# EAGLE design mixJTAG (EAGLE 7.2.0)

## Sheet 1 of 2
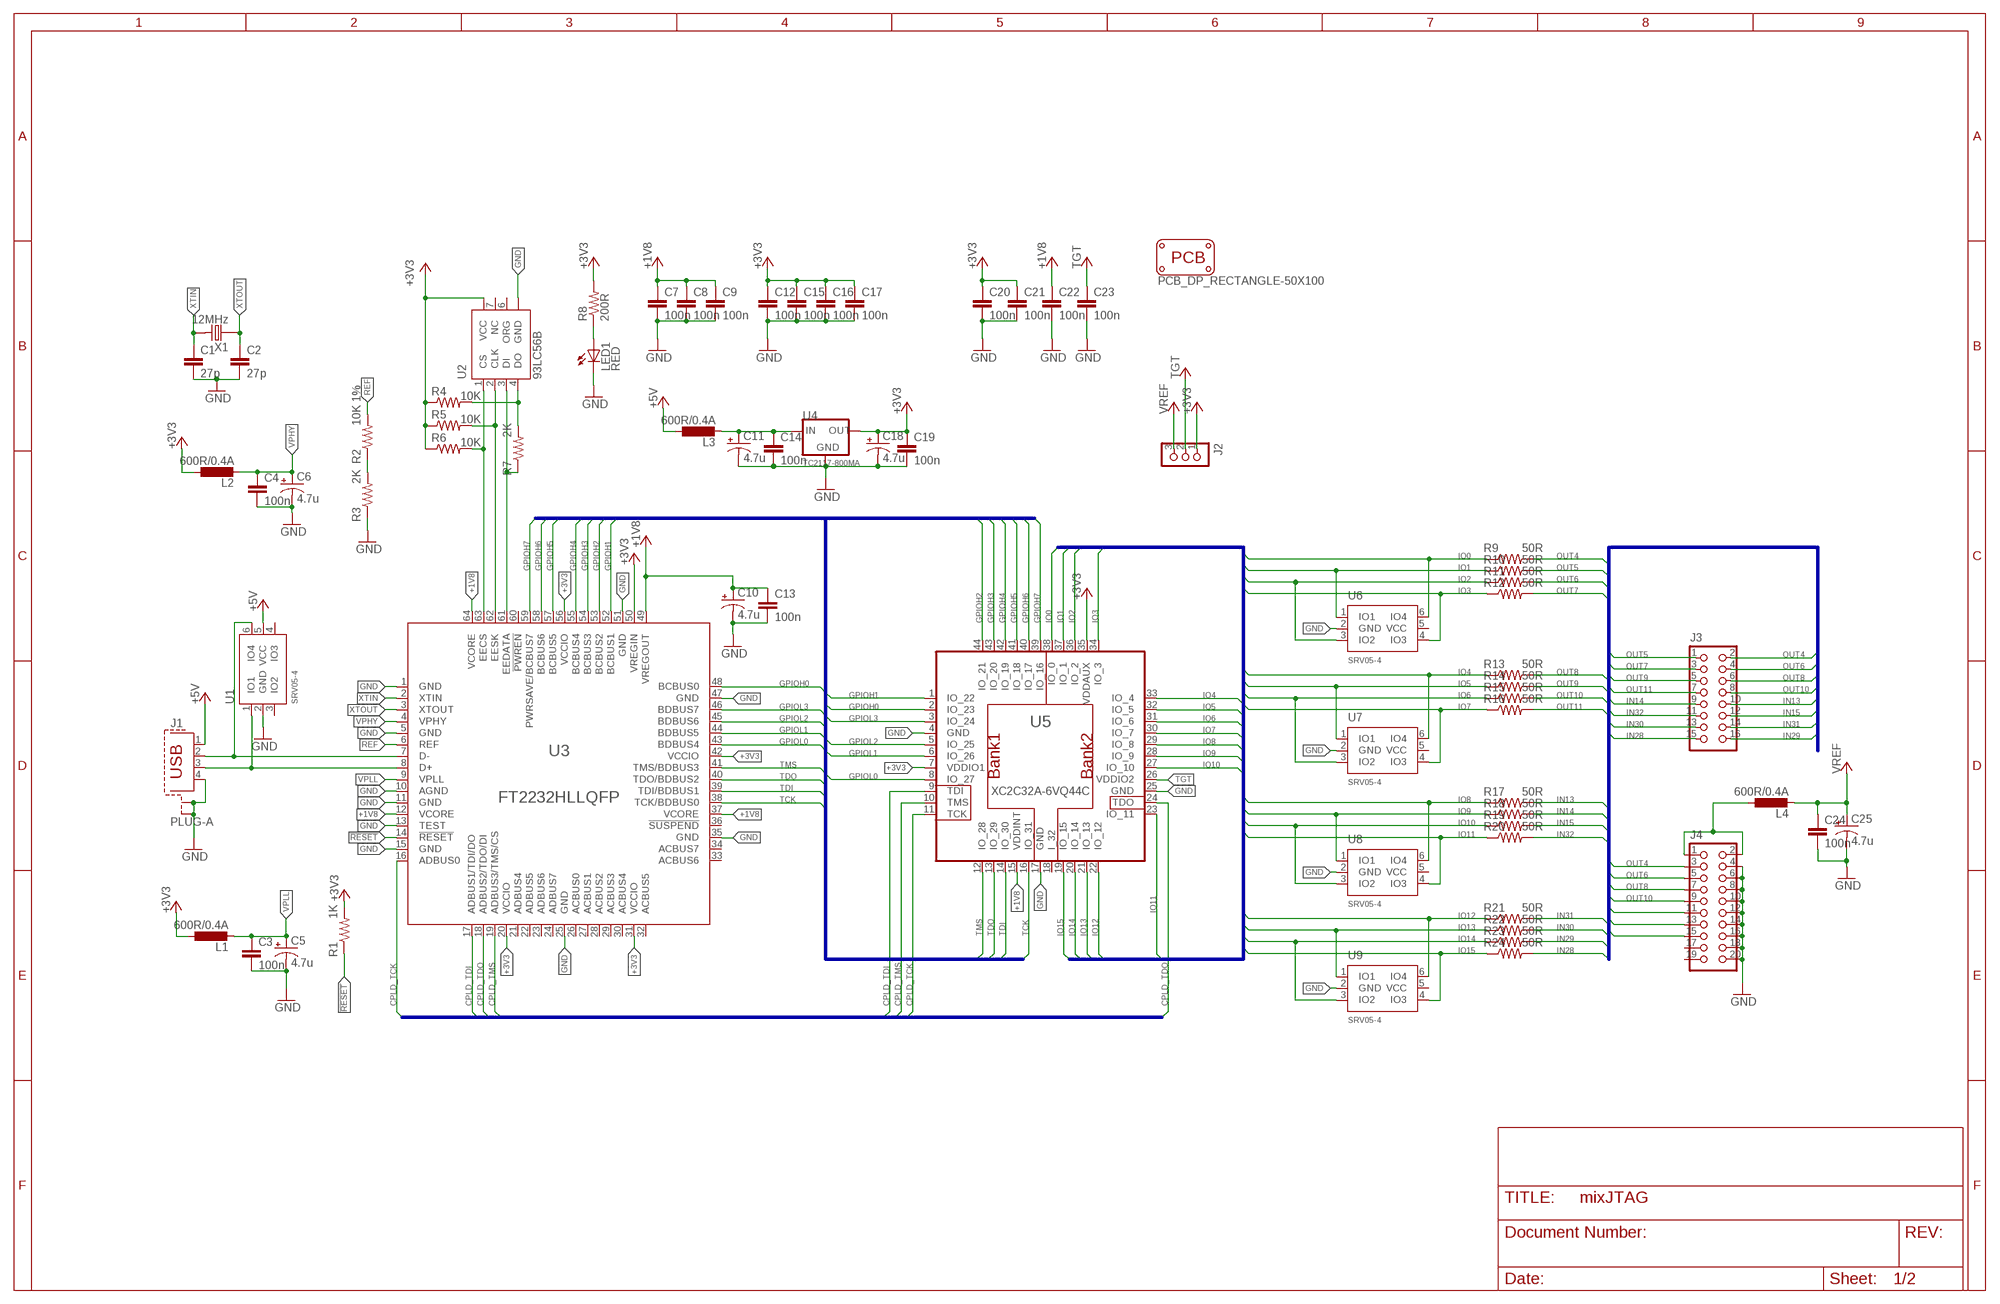
[diagram p0: schematic, sheet 1]

### Parts
C1  27p  C-EUC0805  [C0805]
C2  27p  C-EUC0805  [C0805]
C3  100n  C-EUC0805  [C0805]
C4  100n  C-EUC0805  [C0805]
C5  4.7u  CPOL-USA/3216-18R  [A/3216-18R]
C6  4.7u  CPOL-USA/3216-18R  [A/3216-18R]
C7  100n  C-EUC0805  [C0805]
C8  100n  C-EUC0805  [C0805]
C9  100n  C-EUC0805  [C0805]
C10  4.7u  CPOL-USA/3216-18R  [A/3216-18R]
C11  4.7u  CPOL-USA/3216-18R  [A/3216-18R]
C12  100n  C-EUC0805  [C0805]
C13  100n  C-EUC0805  [C0805]
C14  100n  C-EUC0805  [C0805]
C15  100n  C-EUC0805  [C0805]
C16  100n  C-EUC0805  [C0805]
C17  100n  C-EUC0805  [C0805]
C18  4.7u  CPOL-USA/3216-18R  [A/3216-18R]
C19  100n  C-EUC0805  [C0805]
C20  100n  C-EUC0805  [C0805]
C21  100n  C-EUC0805  [C0805]
C22  100n  C-EUC0805  [C0805]
C23  100n  C-EUC0805  [C0805]
C24  100n  C-EUC0805  [C0805]
C25  4.7u  CPOL-USA/3216-18R  [A/3216-18R]
J1  PLUG-A  USBPLUG-A  [USB-A-HOLE-PLUG]
J2  CON_HEADER_1X03-PTH  [M1X3]
J3  CON_HEADER_2X08  [M2X8]
J4  CON_HEADER_2X10-PTH  [M2X10]
L1  600R/0.4A  L-EUL2012C  [L2012C]
L2  600R/0.4A  L-EUL2012C  [L2012C]
L3  600R/0.4A  L-EUL2012C  [L2012C]
L4  600R/0.4A  L-EUL2012C  [L2012C]
LED1  RED  LEDCHIP-LED0805  [CHIP-LED0805]
PCB1  PCB_DP_RECTANGLE-50X100  [DP10050_V1]
R1  1K  R-US_R0805  [R0805]
R2  10K 1%  R-US_R0805  [R0805]
R3  2K  R-US_R0805  [R0805]
R4  10K  R-US_R0805  [R0805]
R5  10K  R-US_R0805  [R0805]
R6  10K  R-US_R0805  [R0805]
R7  2K  R-US_R0805  [R0805]
R8  200R  R-US_R0805  [R0805]
R9  50R  R-US_R0805  [R0805]
R10  50R  R-US_R0805  [R0805]
R11  50R  R-US_R0805  [R0805]
R12  50R  R-US_R0805  [R0805]
R13  50R  R-US_R0805  [R0805]
R14  50R  R-US_R0805  [R0805]
R15  50R  R-US_R0805  [R0805]
R16  50R  R-US_R0805  [R0805]
R17  50R  R-US_R0805  [R0805]
R18  50R  R-US_R0805  [R0805]
R19  50R  R-US_R0805  [R0805]
R20  50R  R-US_R0805  [R0805]
R21  50R  R-US_R0805  [R0805]
R22  50R  R-US_R0805  [R0805]
R23  50R  R-US_R0805  [R0805]
R24  50R  R-US_R0805  [R0805]
U1  SRV05-4  [SOT23-6]
U2  93LC56B  PIN2PIN-SOIC8  [SOIC8]
U3  FT2232HLLQFP  [LQFP-64]
U4  TC2117-800MA  [SOT223]
U5  XC2C32A-6VQ44C  [VQ-44]
U6  SRV05-4  [SOT23-6]
U7  SRV05-4  [SOT23-6]
U8  SRV05-4  [SOT23-6]
U9  SRV05-4  [SOT23-6]
X1  12MHz  XTSMD5032  [IQG5032A]

### Nets
!RESET: R1.1 U3.14(!RESET)
+1V8: C7.1 C8.1 C9.1 C10.+ C13.1 C22.1 U3.12(VCORE) U3.37(VCORE) U3.49(VREGOUT) U3.64(VCORE) U5.15(VDDINT)
+3V3: C12.1 C15.1 C16.1 C17.1 C18.+ C19.1 C20.1 C21.1 J2.1 L1.1 L2.1 R1.2 R4.1 R5.1 R6.1 R8.2 U2.8(VCC) U3.20(VCCIO) U3.31(VCCIO) U3.42(VCCIO) U3.50(VREGIN) U3.56(VCCIO) U4.2(OUT) U5.7(VDDIO1) U5.35(VDDAUX)
+5V: J1.1 L3.1 U1.5(VCC)
CPLD_TCK: U3.16(ADBUS0) U5.11(TCK)
CPLD_TDI: U3.17(ADBUS1/TDI/DO) U5.9(TDI)
CPLD_TDO: U3.18(ADBUS2/TDO/DI) U5.24(TDO)
CPLD_TMS: U3.19(ADBUS3/TMS/CS) U5.10(TMS)
EECS: R6.2 U2.1(CS) U3.63(EECS)
EEDATA: R7.1 U2.3(DI) U3.61(EEDATA)
EESK: R5.2 U2.2(CLK) U3.62(EESK)
GND: C1.2 C2.2 C3.2 C4.2 C5.- C6.- C7.2 C8.2 C9.2 C10.- C11.- C12.2 C13.2 C14.2 C15.2 C16.2 C17.2 C18.- C19.2 C20.2 C21.2 C22.2 C23.2 C24.2 C25.- J1.4 J1.S1 J1.S2 J4.4 J4.6 J4.8 J4.10 J4.12 J4.14 J4.16 J4.18 J4.20 LED1.C R3.1 U1.2(GND) U2.5(GND) U3.1(GND) U3.5(GND) U3.10(AGND) U3.11(GND) U3.13(TEST) U3.15(GND) U3.25(GND) U3.35(GND) U3.47(GND) U3.51(GND) U4.1(GND) U5.4(GND) U5.17(GND) U5.25(GND) U6.2(GND) U7.2(GND) U8.2(GND) U9.2(GND)
GPIOH0: U3.48(BCBUS0) U5.2(IO_23)
GPIOH1: U3.52(BCBUS1) U5.1(IO_22)
GPIOH2: U3.53(BCBUS2) U5.44(IO_21)
GPIOH3: U3.54(BCBUS3) U5.43(IO_20)
GPIOH4: U3.55(BCBUS4) U5.42(IO_19)
GPIOH5: U3.57(BCBUS5) U5.41(IO_18)
GPIOH6: U3.58(BCBUS6) U5.40(IO_17)
GPIOH7: U3.59(PWRSAVE/BCBUS7) U5.39(IO_16)
GPIOL0: U3.43(BDBUS4) U5.8(IO_27)
GPIOL1: U3.44(BDBUS5) U5.6(IO_26)
GPIOL2: U3.45(BDBUS6) U5.5(IO_25)
GPIOL3: U3.46(BDBUS7) U5.3(IO_24)
IN13: J3.10 J4.11 R17.2
IN14: J3.9 R18.2
IN15: J3.12 J4.13 R19.2
IN28: J3.15 R24.2
IN29: J3.16 R23.2
IN30: J3.13 R22.2
IN31: J3.14 J4.15 R21.2
IN32: J3.11 R20.2
IO0: R9.1 U5.38(IO_0) U6.6(IO4)
IO1: R10.1 U5.37(IO_1) U6.1(IO1)
IO2: R11.1 U5.36(IO_2) U6.3(IO2)
IO3: R12.1 U5.34(IO_3) U6.4(IO3)
IO4: R13.1 U5.33(IO_4) U7.6(IO4)
IO5: R14.1 U5.32(IO_5) U7.1(IO1)
IO6: R15.1 U5.31(IO_6) U7.3(IO2)
IO7: R16.1 U5.30(IO_7) U7.4(IO3)
IO8: R17.1 U5.29(IO_8) U8.6(IO4)
IO9: R18.1 U5.28(IO_9) U8.1(IO1)
IO10: R19.1 U5.27(IO_10) U8.3(IO2)
IO11: R20.1 U5.23(IO_11) U8.4(IO3)
IO12: R21.1 U5.22(IO_12) U9.6(IO4)
IO13: R22.1 U5.21(IO_13) U9.1(IO1)
IO14: R23.1 U5.20(IO_14) U9.3(IO2)
IO15: R24.1 U5.19(IO_15) U9.4(IO3)
N$1: J1.2 U1.6(IO4) U3.7(D-)
N$2: J1.3 U1.1(IO1) U3.8(D+)
N$3: C11.+ C14.1 L3.2 U4.3(IN)
N$4: J4.1 J4.2 L4.1
N$5: R2.1 R3.2
N$6: LED1.A R8.1
N$13: R4.2 R7.2 U2.4(DO)
OUT4: J3.2 J4.3 R9.2
OUT5: J3.1 R10.2
OUT6: J3.4 J4.5 R11.2
OUT7: J3.3 R12.2
OUT8: J3.6 J4.7 R13.2
OUT9: J3.5 R14.2
OUT10: J3.8 J4.9 R15.2
OUT11: J3.7 R16.2
REF: R2.2 U3.6(REF)
TCK: U3.38(TCK/BDBUS0) U5.16(IO_31)
TDI: U3.39(TDI/BDBUS1) U5.14(IO_30)
TDO: U3.40(TDO/BDBUS2) U5.13(IO_29)
TGT: C23.1 J2.2 U5.26(VDDIO2)
TMS: U3.41(TMS/BDBUS3) U5.12(IO_28)
VPHY: C4.1 C6.+ L2.2 U3.4(VPHY)
VPLL: C3.1 C5.+ L1.2 U3.9(VPLL)
VREF: C24.1 C25.+ J2.3 L4.2
XTIN: C1.1 U3.2(XTIN) X1.P$2
XTOUT: C2.1 U3.3(XTOUT) X1.P$1
Unconnected: J4.17 J4.19 U1.3(IO2) U1.4(IO3) U2.6(ORG) U2.7(NC) U3.21(ADBUS4) U3.22(ADBUS5) U3.23(ADBUS6) U3.24(ADBUS7) U3.26(ACBUS0) U3.27(ACBUS1) U3.28(ACBUS2) U3.29(ACBUS3) U3.30(ACBUS4) U3.32(ACBUS5) U3.33(ACBUS6) U3.34(ACBUS7) U3.36(!SUSPEND) U3.60(!PWREN) U5.18(I_32) U6.5(VCC) U7.5(VCC) U8.5(VCC) U9.5(VCC)

### Buses
TCK,TDI,TDO,TMS,GPIOL[0..3],GPIOH[0..7]
CPLD_TMS,CPLD_TDI,CPLD_TDO,CPLD_TCK
IO[0..15]
OUT[4..11],IN[13..15],IN[28..32]

## Sheet 2 of 2
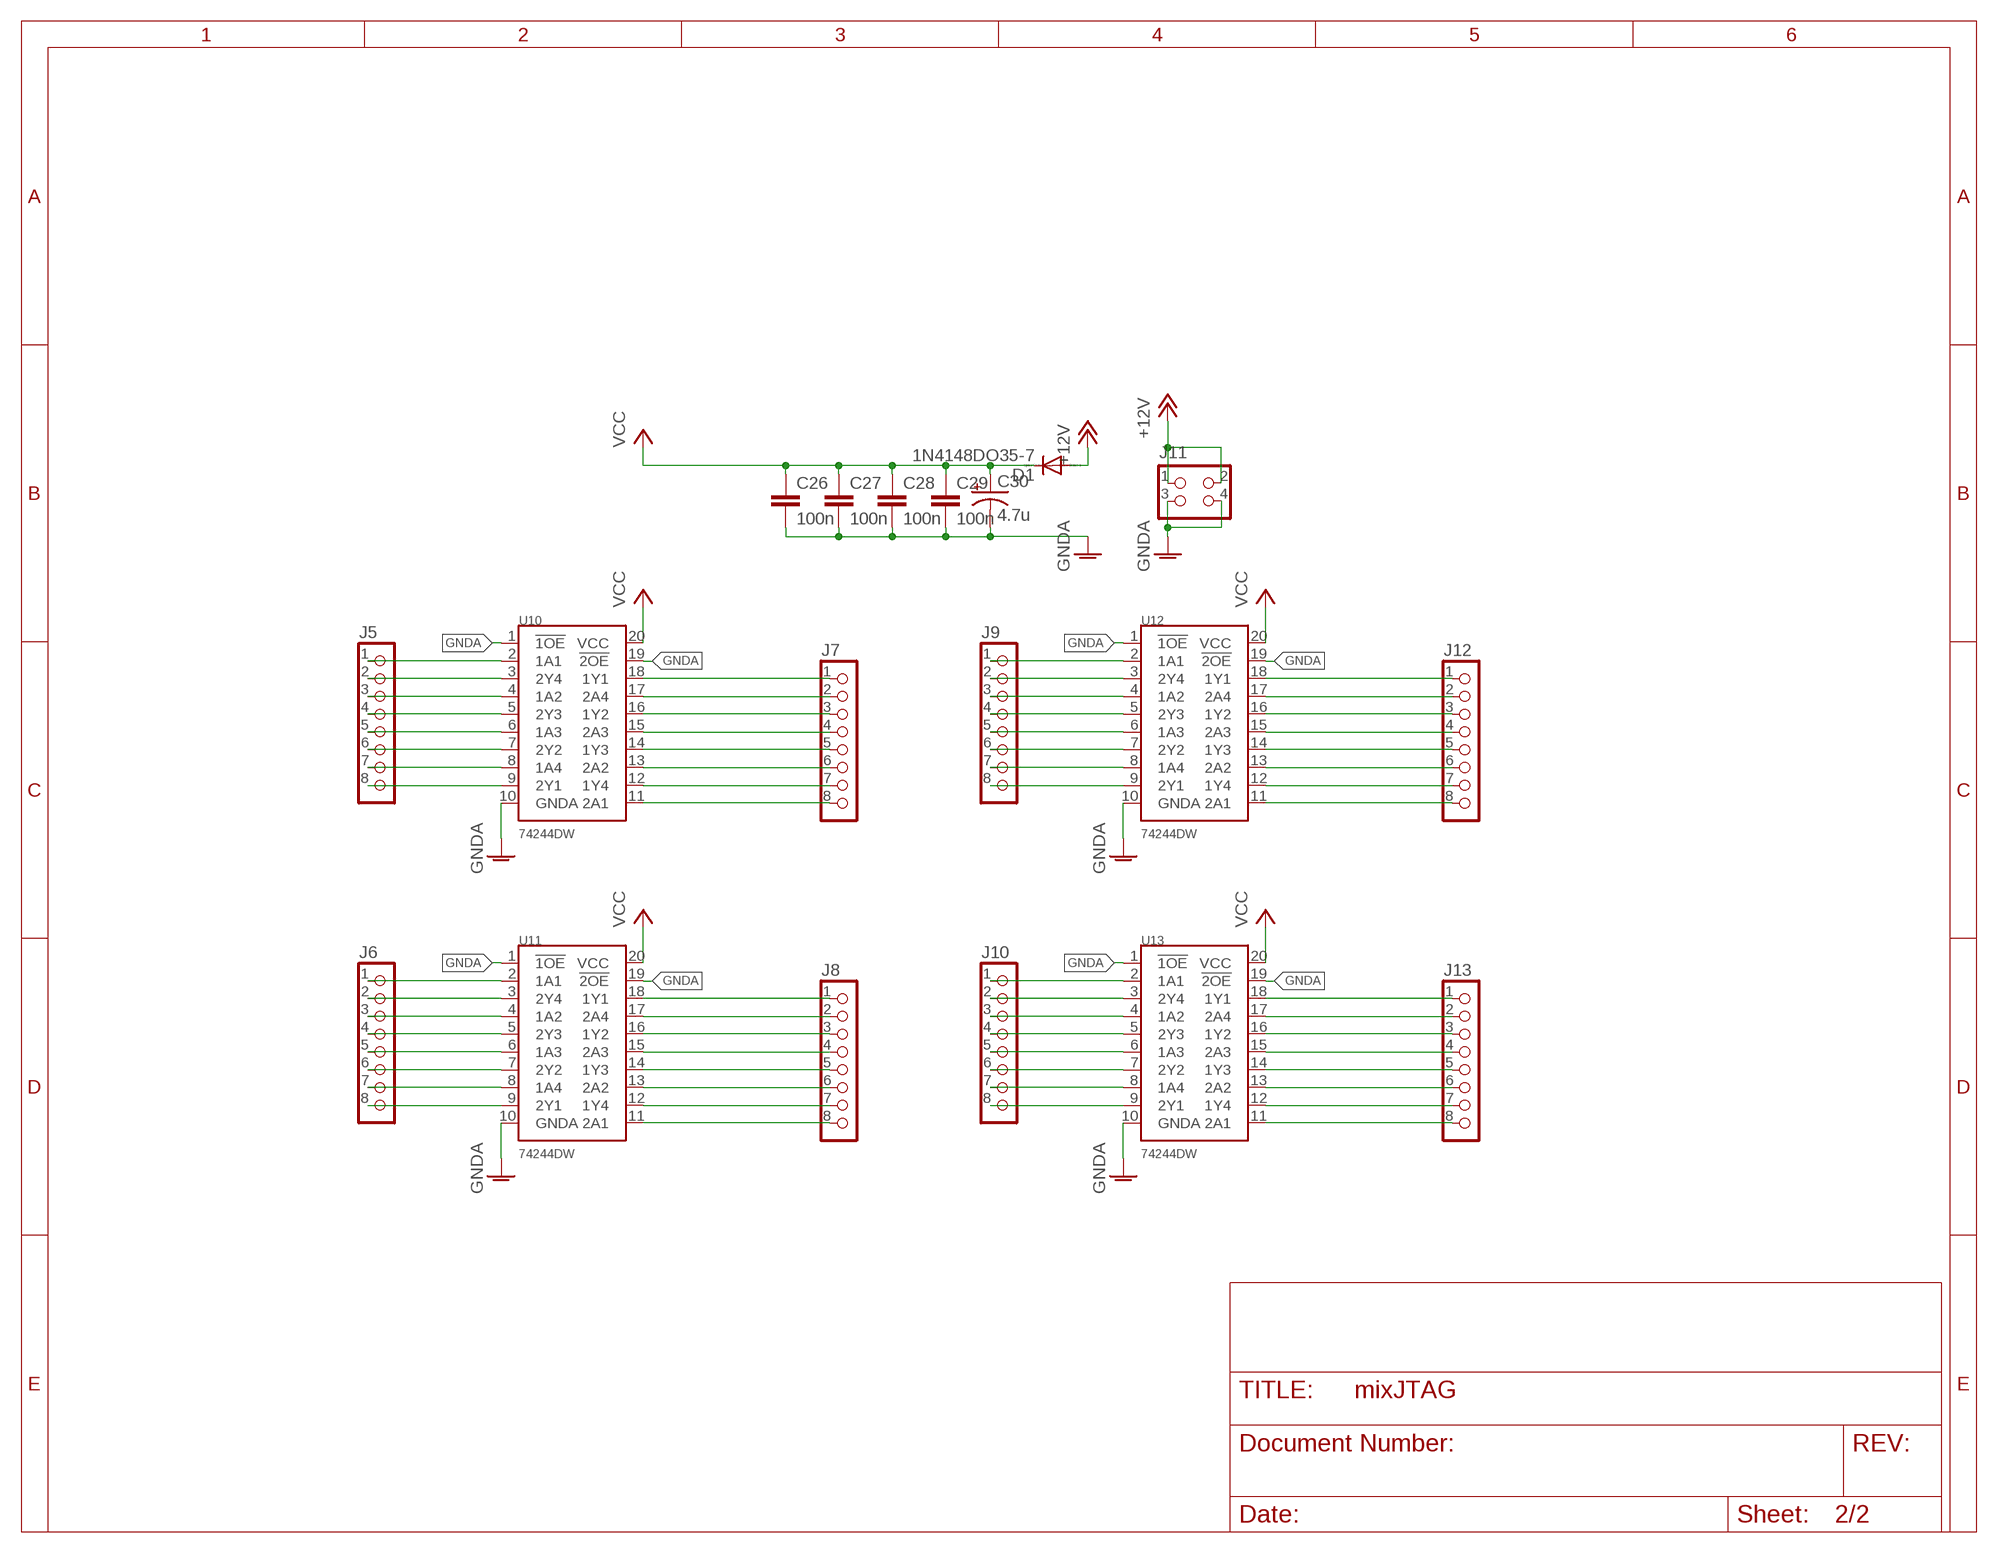
[diagram p1: schematic, sheet 2]

### Parts
C26  100n  C-EUC0805  [C0805]
C27  100n  C-EUC0805  [C0805]
C28  100n  C-EUC0805  [C0805]
C29  100n  C-EUC0805  [C0805]
C30  4.7u  CPOL-USA/3216-18R  [A/3216-18R]
D1  1N4148DO35-7  [DO35-7]
J5  CON_HEADER_1X08-PTH  [M1X8]
J6  CON_HEADER_1X08-PTH  [M1X8]
J7  CON_HEADER_1X08-PTH  [M1X8]
J8  CON_HEADER_1X08-PTH  [M1X8]
J9  CON_HEADER_1X08-PTH  [M1X8]
J10  CON_HEADER_1X08-PTH  [M1X8]
J11  CON_HEADER_2X02-PTH  [M2X2]
J12  CON_HEADER_1X08-PTH  [M1X8]
J13  CON_HEADER_1X08-PTH  [M1X8]
U10  74244DW  [SO20W]
U11  74244DW  [SO20W]
U12  74244DW  [SO20W]
U13  74244DW  [SO20W]

### Nets
+12V: D1.A J11.1 J11.2
GNDA: C26.2 C27.2 C28.2 C29.2 C30.- J11.3 J11.4 U10.1(!1OE) U10.10(GNDA) U10.19(!2OE) U11.1(!1OE) U11.10(GNDA) U11.19(!2OE) U12.1(!1OE) U12.10(GNDA) U12.19(!2OE) U13.1(!1OE) U13.10(GNDA) U13.19(!2OE)
N$7: J5.8 U10.9(2Y1)
N$8: J5.7 U10.8(1A4)
N$9: J5.6 U10.7(2Y2)
N$10: J5.5 U10.6(1A3)
N$11: J5.4 U10.5(2Y3)
N$12: J5.3 U10.4(1A2)
N$14: J5.2 U10.3(2Y4)
N$15: J5.1 U10.2(1A1)
N$16: J7.8 U10.11(2A1)
N$17: J7.7 U10.12(1Y4)
N$18: J7.6 U10.13(2A2)
N$19: J7.5 U10.14(1Y3)
N$20: J7.4 U10.15(2A3)
N$21: J7.3 U10.16(1Y2)
N$22: J7.2 U10.17(2A4)
N$23: J7.1 U10.18(1Y1)
N$24: J6.8 U11.9(2Y1)
N$25: J6.7 U11.8(1A4)
N$26: J6.6 U11.7(2Y2)
N$27: J6.5 U11.6(1A3)
N$28: J6.4 U11.5(2Y3)
N$29: J6.3 U11.4(1A2)
N$30: J6.2 U11.3(2Y4)
N$31: J6.1 U11.2(1A1)
N$32: J8.8 U11.11(2A1)
N$33: J8.7 U11.12(1Y4)
N$34: J8.6 U11.13(2A2)
N$35: J8.5 U11.14(1Y3)
N$36: J8.4 U11.15(2A3)
N$37: J8.3 U11.16(1Y2)
N$38: J8.2 U11.17(2A4)
N$39: J8.1 U11.18(1Y1)
N$40: J9.8 U12.9(2Y1)
N$41: J9.7 U12.8(1A4)
N$42: J9.6 U12.7(2Y2)
N$43: J9.5 U12.6(1A3)
N$44: J9.4 U12.5(2Y3)
N$45: J9.3 U12.4(1A2)
N$46: J9.2 U12.3(2Y4)
N$47: J9.1 U12.2(1A1)
N$48: J12.8 U12.11(2A1)
N$49: J12.7 U12.12(1Y4)
N$50: J12.6 U12.13(2A2)
N$51: J12.5 U12.14(1Y3)
N$52: J12.4 U12.15(2A3)
N$53: J12.3 U12.16(1Y2)
N$54: J12.2 U12.17(2A4)
N$55: J12.1 U12.18(1Y1)
N$56: J10.8 U13.9(2Y1)
N$57: J10.7 U13.8(1A4)
N$58: J10.6 U13.7(2Y2)
N$59: J10.5 U13.6(1A3)
N$60: J10.4 U13.5(2Y3)
N$61: J10.3 U13.4(1A2)
N$62: J10.2 U13.3(2Y4)
N$63: J10.1 U13.2(1A1)
N$64: J13.8 U13.11(2A1)
N$65: J13.7 U13.12(1Y4)
N$66: J13.6 U13.13(2A2)
N$67: J13.5 U13.14(1Y3)
N$68: J13.4 U13.15(2A3)
N$69: J13.3 U13.16(1Y2)
N$70: J13.2 U13.17(2A4)
N$71: J13.1 U13.18(1Y1)
VCC: C26.1 C27.1 C28.1 C29.1 C30.+ D1.C U10.20(VCC) U11.20(VCC) U12.20(VCC) U13.20(VCC)

## Library data of the parts
C1-C4 C7-C9 C12-C17 C19-C24 C26-C29 = rcl:C-EU: CAPACITOR, European symbol
C5 C6 C10 C11 C18 C25 C30 = rcl:CPOL-US: POLARIZED CAPACITOR, American symbol
D1 = diode:1N4148: DIODE high speed (Philips)
J1 = bb_con-usb:USB: USB connector with sheild
J2 = bb_pinheader:CON_HEADER_1X03
J3 = bb_pinheader:CON_HEADER_2X08
J4 = bb_pinheader:CON_HEADER_2X10
J5-J10 J12 J13 = bb_pinheader:CON_HEADER_1X08
J11 = bb_pinheader:CON_HEADER_2X02
L1-L4 = rcl:L-EU: INDUCTOR, European symbol
LED1 = led:LED: LED OSRAM: - CHIPLED LG R971, LG N971, LY N971, LG Q971, LY Q971, LO R971, LY R971 LH N974, LH R974 LS Q976, LO Q976, LY Q976 LO Q996 - Hyper CHIPLED LW Q18S LB Q993, LB Q99A, LB R99A - SideLED LS A670, LO A670, LY A670, LG A670, LP A670 LB A673, LV A673, LT A673, LW A673 LH A674 LY A675 LS A676, LA A676, LO A676, LY A676, LW A676 LS A679, LY A679, LG A679 - Hyper Micro SIDELED® LS Y876, LA Y876, LO Y876, LY Y876 LT Y87S - SmartLED LW L88C, LW L88S LB L89C, LB L89S, LG L890 LS L89K, LO L89K, LY L89K LS L896, LA L896, LO L896, LY L896 - TOPLED LS T670, LO T670, LY T670, LG T670, LP T670 LSG T670, LSP T670, LSY T670, LOP T670, LYG T670 LG T671, LOG T671, LSG T671 LB T673, LV T673, LT T673, LW T673 LH T674 LS T676, LA T676, LO T676, LY T676, LB T676, LH T676, LSB T676, LW T676 LB T67C, LV T67C, LT T67C, LS T67K, LO T67K, LY T67K, LW E67C LS E67B, LA E67B, LO E67B, LY E67B, LB E67C, LV E67C, LT E67C LW T67C LS T679, LY T679, LG T679 LS T770, LO T770, LY T770, LG T770, LP T770 LB T773, LV T773, LT T773, LW T773 LH T774 LS E675, LA E675, LY E675, LS T675 LS T776, LA T776, LO T776, LY T776, LB T776 LHGB T686 LT T68C, LB T68C - Hyper Mini TOPLED® LB M676 - Mini TOPLED Santana® LG M470 LS M47K, LO M47K, LY M47K Source: http://www.osram.convergy.de LUXEON: - LUMILED® LXK2-PW12-R00, LXK2-PW12-S00, LXK2-PW14-U00, LXK2-PW14-V00 LXK2-PM12-R00, LXK2-PM12-S00, LXK2-PM14-U00 LXK2-PE12-Q00, LXK2-PE12-R00, LXK2-PE12-S00, LXK2-PE14-T00, LXK2-PE14-U00 LXK2-PB12-K00, LXK2-PB12-L00, LXK2-PB12-M00, LXK2-PB14-N00, LXK2-PB14-P00, LXK2-PB14-Q00 LXK2-PR12-L00, LXK2-PR12-M00, LXK2-PR14-Q00, LXK2-PR14-R00 LXK2-PD12-Q00, LXK2-PD12-R00, LXK2-PD12-S00 LXK2-PH12-R00, LXK2-PH12-S00 LXK2-PL12-P00, LXK2-PL12-Q00, LXK2-PL12-R00 Source: www.luxeon.com KINGBRIGHT: KA-3528ASYC Source: www.kingbright.com
PCB1 = bb_pcb:PCB_DP_RECTANGLE: Dangerous Prototypes Standard Rectangular PCB sizes
R1-R24 = rcl:R-US_: RESISTOR, American symbol
U1 U6-U9 = bb_tvs:SRV05-4
U2 = bb_93LC56B:PIN2PIN-SOIC8
U3 = bb_ft2232hl:FT2232HL: FT2232H
U4 = bb_ldo:TC2117-800MA
U5 = bb_xc2c32a:XC2C32A-6VQ44C: xc2c32a_vq44-ian edit this description Auto generated by make-symbol-device-package-bsdl.ulp Rev. 29 Source: xc2c32a_vq44-ian.bsd
U10-U13 = bb_74:74244
X1 = bb_crystal:XT

## Board
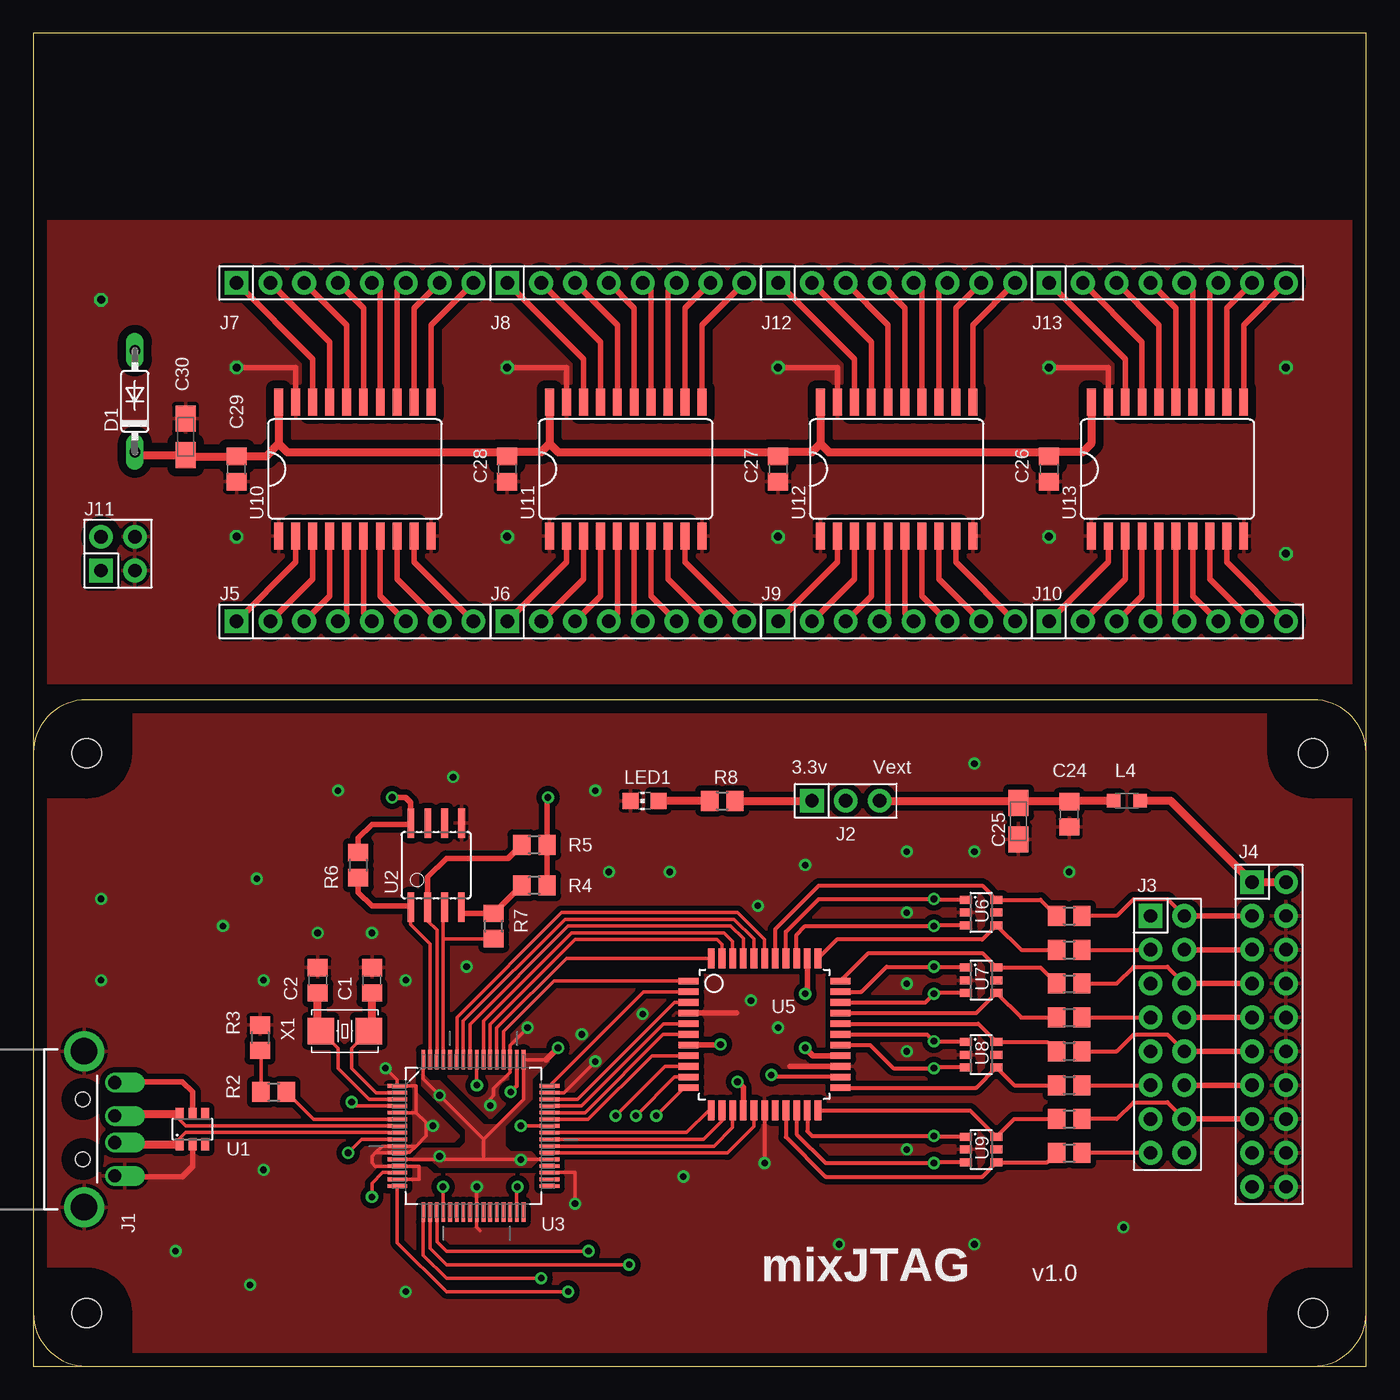
[diagram p2: board, top side]
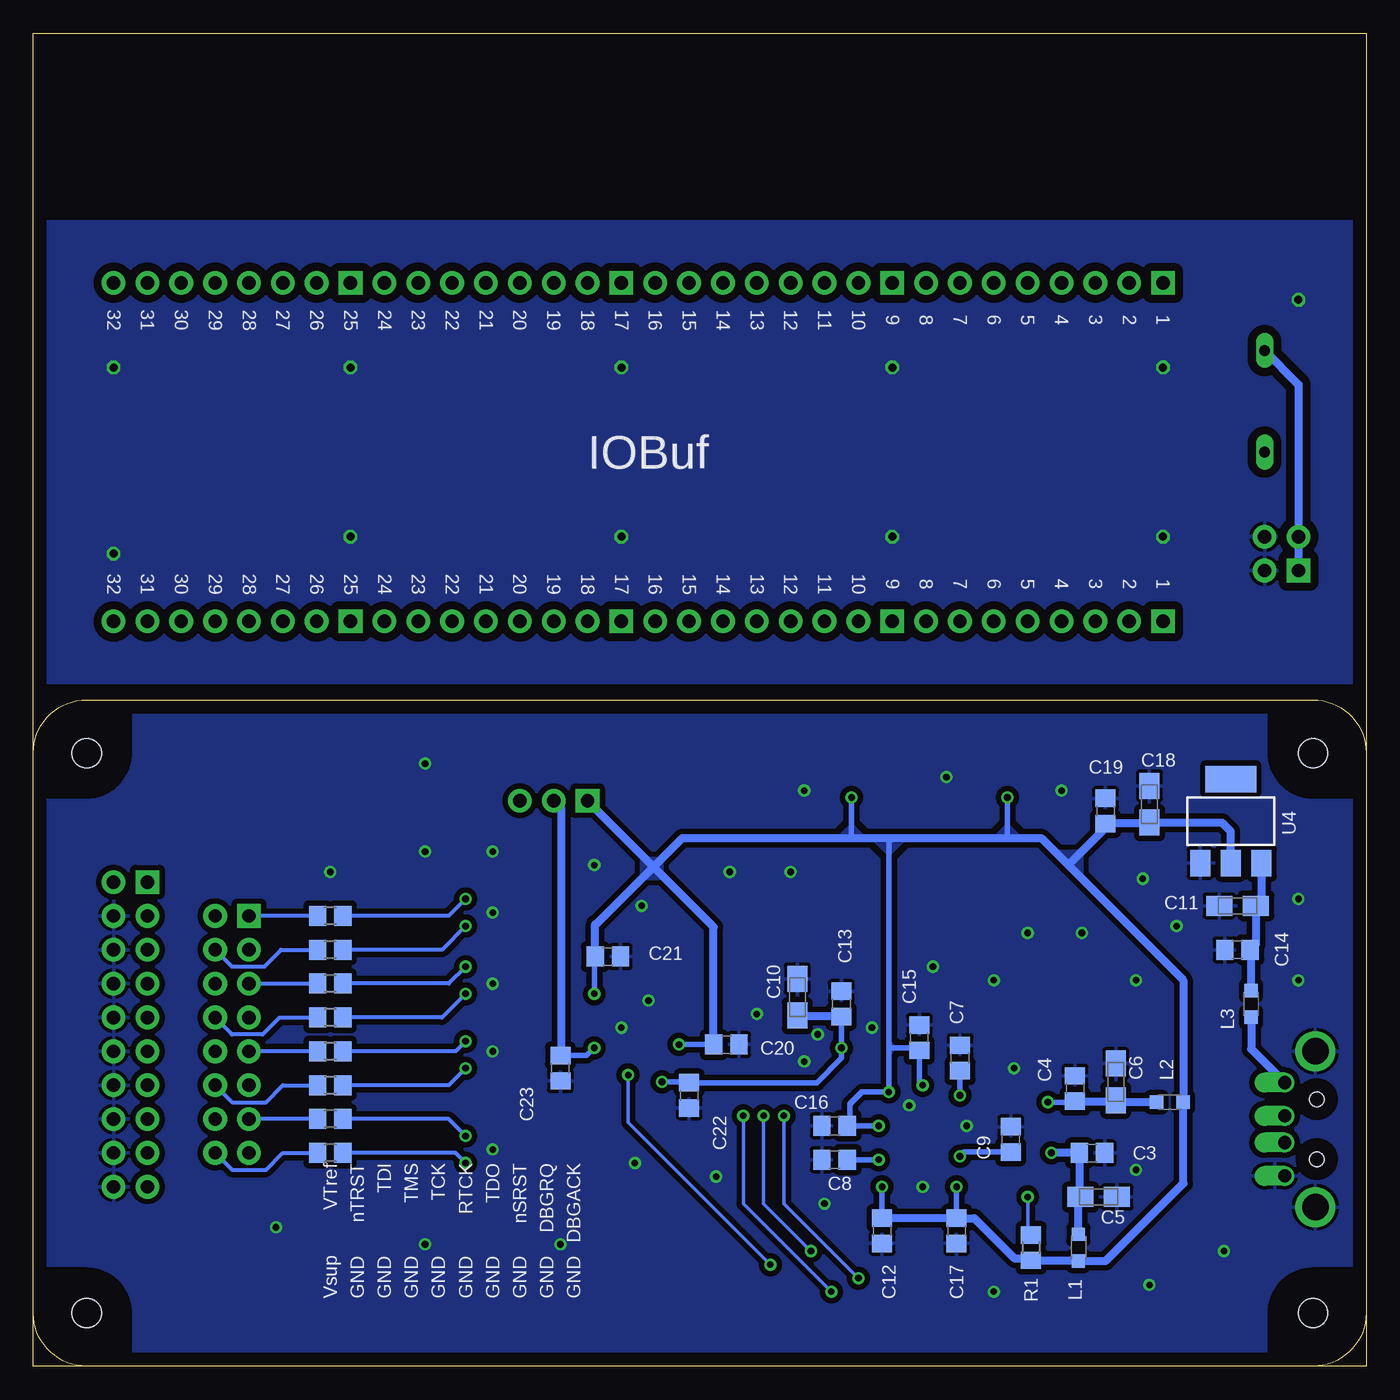
[diagram p3: board, bottom side, seen from below]

Size 100 x 100 mm. Coordinates in mm from the lower left corner, seen from the top.
Outline: 0,0 100,0 100,100 0,100 0,0
Copper layers (1*16): Top 0.035mm / dielectric 1.5mm / Bottom 0.035mm
Design rules "mixJTAG": minimum track width 10mil, minimum drill 19mil, track to track 8mil, track to pad 8mil, pad to pad 8mil, via to via 12mil, smd to smd 8mil, copper to edge 40mil, drill to drill 16mil, minimum pad ring 10mil, minimum via ring 8mil, stop-mask expansion 4mil, vias tented up to drill 0mil, thermal gap 10mil

### Footprints (pad centres in the part's own frame; a part is rotated, then mirrored left to right if it is on the bottom)
C0805 = smd 1.3 x 1.5: 1 -0.95,0; 2 0.95,0
A/3216-18R = smd 1.95 x 1.5: + 1.375,0; - -1.375,0
DO35-7 = drill 0.813 long: A 3.81,0; C -3.81,0
USB-A-HOLE-PLUG = drill 1 offset: 1 2.3,3.5; 2 2.3,1; 3 2.3,-1; 4 2.3,-3.5 | drill 2: S1 0,5.85; S2 0,-5.85 | hole 1.1: -0.1,2.25; -0.1,-2.25
M1X3 = drill 1 pad 1.778 square: 1 0,0 | drill 1 pad 1.778: 2 2.54,0; 3 5.08,0
M2X8 = drill 1 pad 1.778 square: 1 -8.89,-1.27 | drill 1 pad 1.778: 2 -8.89,1.27; 3 -6.35,-1.27; 4 -6.35,1.27; 5 -3.81,-1.27; 6 -3.81,1.27; 7 -1.27,-1.27; 8 -1.27,1.27; 9 1.27,-1.27; 10 1.27,1.27; 11 3.81,-1.27; 12 3.81,1.27; 13 6.35,-1.27; 14 6.35,1.27; 15 8.89,-1.27; 16 8.89,1.27
M2X10 = drill 1 pad 1.778 square: 1 -11.43,-1.27 | drill 1 pad 1.778: 2 -11.43,1.27; 3 -8.89,-1.27; 4 -8.89,1.27; 5 -6.35,-1.27; 6 -6.35,1.27; 7 -3.81,-1.27; 8 -3.81,1.27; 9 -1.27,-1.27; 10 -1.27,1.27; 11 1.27,-1.27; 12 1.27,1.27; 13 3.81,-1.27; 14 3.81,1.27; 15 6.35,-1.27; 16 6.35,1.27; 17 8.89,-1.27; 18 8.89,1.27; 19 11.43,-1.27; 20 11.43,1.27
M1X8 = drill 1 pad 1.778 square: 1 -8.89,0 | drill 1 pad 1.778: 2 -6.35,0; 3 -3.81,0; 4 -1.27,0; 5 1.27,0; 6 3.81,0; 7 6.35,0; 8 8.89,0
M2X2 = drill 1 pad 1.778 square: 1 -1.27,-1.27 | drill 1 pad 1.778: 2 -1.27,1.27; 3 1.27,-1.27; 4 1.27,1.27
L2012C = smd 1 x 1: 1 -1,0; 2 1,0
CHIP-LED0805 = smd 1.2 x 1.2: A 0,-1.05; C 0,1.05
DP10050_V1 = hole 2.2: 4,4; 96,4; 96,46; 4,46
R0805 = smd 1.3 x 1.5: 1 -0.95,0; 2 0.95,0
SOT23-6 = smd 0.6 x 0.9: 1 -0.95,-1.15; 2 0,-1.15; 3 0.95,-1.15; 4 0.95,1.15; 5 0,1.15; 6 -0.95,1.15
SOIC8 = smd 0.5 x 2.2: 1 -1.905,-3.154; 2 -0.645,-3.154; 3 0.625,-3.154; 4 1.895,-3.154; 5 1.905,3.154; 6 0.635,3.154; 7 -0.635,3.154; 8 -1.905,3.154
LQFP-64 = smd 1.473 x 0.279: 1 -5.715,3.759; 2 -5.715,3.251; 3 -5.715,2.743; 4 -5.715,2.261; 5 -5.715,1.753; 6 -5.715,1.245; 7 -5.715,0.762; 8 -5.715,0.254; 9 -5.715,-0.254; 10 -5.715,-0.762; 11 -5.715,-1.245; 12 -5.715,-1.753; 13 -5.715,-2.261; 14 -5.715,-2.743; 15 -5.715,-3.251; 16 -5.715,-3.759; 33 5.715,-3.759; 34 5.715,-3.251; 35 5.715,-2.743; 36 5.715,-2.261; 37 5.715,-1.753; 38 5.715,-1.245; 39 5.715,-0.762; 40 5.715,-0.254; 41 5.715,0.254; 42 5.715,0.762; 43 5.715,1.245; 44 5.715,1.753; 45 5.715,2.261; 46 5.715,2.743; 47 5.715,3.251; 48 5.715,3.759 | smd 0.279 x 1.473: 17 -3.759,-5.715; 18 -3.251,-5.715; 19 -2.743,-5.715; 20 -2.261,-5.715; 21 -1.753,-5.715; 22 -1.245,-5.715; 23 -0.762,-5.715; 24 -0.254,-5.715; 25 0.254,-5.715; 26 0.762,-5.715; 27 1.245,-5.715; 28 1.753,-5.715; 29 2.261,-5.715; 30 2.743,-5.715; 31 3.251,-5.715; 32 3.759,-5.715; 49 3.759,5.715; 50 3.251,5.715; 51 2.743,5.715; 52 2.261,5.715; 53 1.753,5.715; 54 1.245,5.715; 55 0.762,5.715; 56 0.254,5.715; 57 -0.254,5.715; 58 -0.762,5.715; 59 -1.245,5.715; 60 -1.753,5.715; 61 -2.261,5.715; 62 -2.743,5.715; 63 -3.251,5.715; 64 -3.759,5.715
SOT223 = smd 1.5 x 2: 1 -2.3,-3.15; 2 0,-3.15; 3 2.3,-3.15 | smd 3.8 x 2: 4 0,3.15
VQ-44 = smd 1.5 x 0.5: 1 -5.7,4; 2 -5.7,3.2; 3 -5.7,2.4; 4 -5.7,1.6; 5 -5.7,0.8; 6 -5.7,0; 7 -5.7,-0.8; 8 -5.7,-1.6; 9 -5.7,-2.4; 10 -5.7,-3.2; 11 -5.7,-4; 23 5.7,-4; 24 5.7,-3.2; 25 5.7,-2.4; 26 5.7,-1.6; 27 5.7,-0.8; 28 5.7,0; 29 5.7,0.8; 30 5.7,1.6; 31 5.7,2.4; 32 5.7,3.2; 33 5.7,4 | smd 0.5 x 1.5: 12 -4,-5.7; 13 -3.2,-5.7; 14 -2.4,-5.7; 15 -1.6,-5.7; 16 -0.8,-5.7; 17 0,-5.7; 18 0.8,-5.7; 19 1.6,-5.7; 20 2.4,-5.7; 21 3.2,-5.7; 22 4,-5.7; 34 4,5.7; 35 3.2,5.7; 36 2.4,5.7; 37 1.6,5.7; 38 0.8,5.7; 39 0,5.7; 40 -0.8,5.7; 41 -1.6,5.7; 42 -2.4,5.7; 43 -3.2,5.7; 44 -4,5.7
SO20W = smd 0.66 x 2.032: 1 -5.715,-5.029; 2 -4.445,-5.029; 3 -3.175,-5.029; 4 -1.905,-5.029; 5 -0.635,-5.029; 6 0.635,-5.029; 7 1.905,-5.029; 8 3.175,-5.029; 9 4.445,-5.029; 10 5.715,-5.029; 11 5.715,5.029; 12 4.445,5.029; 13 3.175,5.029; 14 1.905,5.029; 15 0.635,5.029; 16 -0.635,5.029; 17 -1.905,5.029; 18 -3.175,5.029; 19 -4.445,5.029; 20 -5.715,5.029
IQG5032A = smd 2 x 2: P$1 -1.8,0; P$2 1.8,0

### Placement (x,y rotation side)
C1  25.4,28.96 90 top
C2  21.34,28.96 90 top
C3  20.57,16 0 bottom
C4  21.84,20.83 90 bottom
C5  20.07,12.7 180 bottom
C6  18.8,21.34 270 bottom
C7  30.48,23.11 90 bottom
C8  39.88,15.49 180 bottom
C9  26.67,17.02 90 bottom
C10  42.67,27.69 270 bottom
C11  9.65,34.54 0 bottom
C12  36.32,10.16 270 bottom
C13  39.37,27.18 90 bottom
C14  9.65,31.24 180 bottom
C15  33.53,24.64 90 bottom
C16  39.88,18.03 180 bottom
C17  30.73,10.16 270 bottom
C18  16.26,42.16 270 bottom
C19  19.56,41.66 90 bottom
C20  48.01,24.13 0 bottom
C21  56.9,30.73 0 bottom
C22  50.8,20.32 270 bottom
C23  60.45,22.35 270 bottom
C24  77.72,41.4 270 top
C25  73.91,40.89 90 top
C26  76.2,67.31 270 top
C27  55.88,67.31 270 top
C28  35.56,67.31 270 top
C29  15.24,67.31 270 top
C30  11.43,69.72 270 top
D1  7.62,72.39 90 top
J1  3.81,17.78 0 top
J2  58.42,42.42 0 top
J3  85.09,24.89 270 top
J4  92.71,24.89 270 top
J5  24.13,55.88 0 top
J6  44.45,55.88 0 top
J7  24.13,81.28 0 top
J8  44.45,81.28 0 top
J9  64.77,55.88 0 top
J10  85.09,55.88 0 top
J11  6.35,60.96 0 top
J12  64.77,81.28 0 top
J13  85.09,81.28 0 top
L1  21.59,8.89 90 bottom
L2  14.73,19.81 180 bottom
L3  8.64,27.18 90 bottom
L4  82.04,42.42 180 top
LED1  45.85,42.42 90 top
PCB1  0,0 0 top
R1  25.15,8.89 270 bottom
R2  18.03,20.57 0 top
R3  17.02,24.64 270 top
R4  37.59,36.07 180 top
R5  37.59,39.12 180 top
R6  24.38,37.59 270 top
R7  34.54,33.02 90 top
R8  51.69,42.42 0 top
R9  77.72,33.78 0 top
R10  77.72,33.78 180 bottom
R11  77.72,31.24 180 bottom
R12  77.72,31.24 0 top
R13  77.72,28.7 0 top
R14  77.72,28.7 180 bottom
R15  77.72,26.16 180 bottom
R16  77.72,26.16 0 top
R17  77.72,23.62 0 top
R18  77.72,23.62 180 bottom
R19  77.72,21.08 180 bottom
R20  77.72,21.08 0 top
R21  77.72,18.54 0 top
R22  77.72,18.54 180 bottom
R23  77.72,16 180 bottom
R24  77.72,16 0 top
U1  11.94,17.78 0 top
U2  30.23,37.59 0 top
U3  33.02,17.27 0 top
U4  10.16,40.89 0 bottom
U5  54.86,24.89 0 top
U6  71.12,34.04 270 top
U7  71.12,28.96 270 top
U8  71.12,23.37 270 top
U9  71.12,16.26 270 top
U10  24.13,67.31 0 top
U11  44.45,67.31 0 top
U12  64.77,67.31 0 top
U13  85.09,67.31 0 top
X1  23.37,25.15 0 top

### Tracks (layer width: path | path; a pad name or v marks a point on that pad's centre or on a via)
!RESET  (via drill 0.5)
  Top 0.254: U3.14 26.21,14.53 25.4,13.72 v25.4,12.7
  Bottom 0.254: v25.4,12.7 25.4,10.09 R1.1
+1V8  (via drill 0.5)
  Top 0.254: 33.78,15.52 34.04,15.52 U3.37 36.58,15.52 v36.58,15.49 | U3.64 29.26,21.54 v30.48,20.32 33.78,17.02 | 53.34,19.19 U5.15 | 33.78,17.02 36.78,20.02 U3.49 38.48,22.99 | 33.78,17.02 33.78,15.52 | U3.12 30.25,15.52 v30.48,15.75 30.71,15.52 33.78,15.52
  Top 0.406: 38.48,22.99 v39.37,23.88 | U5.15 53.26,20.9 v52.83,21.34
  Bottom 0.406: C13.1 v39.37,23.88 39.37,23.11 41.21,21.27 C22.1 50.87,21.34 v52.83,21.34 | v36.58,15.49 C8.1 | C7.1 v30.48,20.32 | C9.1 30.16,16.07 v30.48,15.75
  Bottom 0.61: C13.1 42.67,26.23 C10.+
  pour Top (no thermals): 28.45,15.49 29.21,16.26 32,16.26 32.51,16.76 32.51,17.78 29.21,21.08 29.21,21.84 29.72,21.34 30.48,21.34 33.78,18.03 34.8,18.03 36.83,20.07 36.83,23.37 38.61,23.37 38.61,22.86 37.34,21.59 37.34,20.07 35.31,18.03 35.31,16.51 35.81,16 37.34,16 37.85,15.49 37.34,14.99 30.48,14.99 29.97,15.49
+3V3  (via drill 0.5)
  Top 0.254: U3.56 v33.27,21.08 | 51.56,24.09 v51.56,24.13 | U3.20 30.76,13.44 v30.73,13.46 | U3.31 36.27,13.41 v36.32,13.46 | U3.42 v36.58,18.03
  Top 0.305: U3.50 36.27,21.03 v35.81,20.57
  Top 0.406: U5.7 51.56,24.09 | R4.1 R5.1 38.54,42.61 v38.61,42.67 | U5.35 58.06,28.09 v57.91,27.94 | v26.92,42.67 27.94,42.67 28.32,42.29 U2.8 28.21,40.64 25.4,40.64 24.38,39.62 R6.1
  Top 0.61: R8.2 J2.1
  Bottom 0.305: 57.91,30.67 C21.1
  Bottom 0.406: v51.56,24.13 C20.1 | U3.42 C16.1 | U3.42 v36.58,18.03 | v30.73,13.46 C17.1 | v36.32,13.46 C12.1 | U3.42 38.73,19.68 37.85,20.57 v35.81,20.57 35.81,23.88 | v57.91,27.94 57.91,30.67 | v26.92,42.67 26.92,39.62 | v38.61,42.67 38.61,39.62 | 35.81,23.88 35.81,39.37 35.56,39.62 | 35.81,23.88 33.53,23.88 C15.1 33.53,21.34 v33.27,21.08
  Bottom 0.61: C12.1 C17.1 29.4,11.11 26.35,8.06 25.27,8.06 R1.2 21.59,7.94 L1.1 19.54,7.89 13.72,13.72 13.72,19.81 L2.1 13.73,28.97 22.35,37.59 | U4.2 10.16,40.13 10.82,40.79 C18.+ 16.34,40.71 C19.1 19.56,40.39 22.35,37.59 | C21.1 57.85,33.15 57.78,33.15 53.47,37.47 | C20.1 48.96,32.95 53.47,37.47 | 53.47,37.47 J2.1 | 53.47,37.47 51.31,39.62 38.61,39.62 35.56,39.62 26.92,39.62 24.38,39.62 22.35,37.59
  pour Bottom (isolate 0.406): 52.83,36.58 52.83,38.1 54.36,38.1 54.36,36.58
  pour Bottom (isolate 0.406): 21.34,38.61 21.34,36.58 23.37,38.61
  pour Bottom (isolate 0.406): 26.92,40.64 25.91,39.62 27.94,39.62
  pour Bottom (isolate 0.406): 38.61,40.64 37.59,39.62 39.62,39.62
  pour Bottom (isolate 0.406): 34.54,39.62 35.81,38.35 37.08,39.62
  pour Bottom (no thermals): 35.31,23.88 35.81,24.38 35.81,23.37
+5V
  Top 0.406: U1.5 11.94,20.57 11.18,21.34 6.17,21.34 J1.1
  Bottom 0.61: L3.1 8.64,23.81 J1.1
+12V
  Bottom 0.61: D1.A 5.08,73.66 J11.2 J11.1
CPLD_TCK  (via drill 0.5)
  Top 0.254: 27.18,13.51 U3.16 27.3,9.27 30.99,5.59 v40.13,5.59 | U5.11 48.83,20.89 v46.74,18.8
  Bottom 0.254: v46.74,18.8 46.74,12.19 v40.13,5.59
CPLD_TDI  (via drill 0.5)
  Top 0.254: U3.17 29.26,8.33 30.99,6.6 v38.1,6.6 | U5.9 47.38,22.49 v43.69,18.8
  Bottom 0.254: v38.1,6.6 43.69,12.19 v43.69,18.8
CPLD_TDO  (via drill 0.5)
  Top 0.254: U3.18 29.77,8.84 30.99,7.62 v44.7,7.62
  Top 0.305: U5.24 55.52,21.69 v55.37,21.84
  Bottom 0.254: v55.37,21.84 55.37,18.29 v44.7,7.62
CPLD_TMS  (via drill 0.5)
  Top 0.254: U3.19 30.28,9.35 30.99,8.64 v41.66,8.64 | U5.10 48.11,21.69 v45.21,18.8
  Bottom 0.254: v45.21,18.8 45.21,12.19 v41.66,8.64
EECS
  Top 0.254: U3.63 29.77,31.7 28.32,33.15 U2.1
  Top 0.406: R6.2 24.38,35.56 25.4,34.54 28.21,34.54 U2.1
EEDATA
  Top 0.254: U3.61 30.76,32.07 | U2.3 30.76,34.35 30.76,32.51 30.76,32.07 | R7.1 30.76,32.07
EESK
  Top 0.254: U3.62 30.28,32.72 29.58,33.41 U2.2
  Top 0.406: U2.2 29.58,36.69 30.99,38.1 35.63,38.1 R5.2
GND  (via drill 0.5)
  Top 0.254: U3.15 28.96,14.02 28.96,15.01 U3.13 25.63,15.01 25.4,15.24 25.4,15.75 25.65,16 | v26.42,22.35 27.3,21.46 U3.1 28.7,21.03 28.7,19.02 U3.5 28.73,19.02 29.46,18.29 29.46,17.27 28.7,16.51 | U3.35 40.64,14.53 v40.64,12.19 | U3.47 39.83,20.52 v42.16,22.86 | U3.11 28.22,16.03 28.7,16.51 | 28.7,16.51 U3.10 26.16,16.51 25.65,16 | v33.27,13.46 U3.25 33.27,10.41 33.53,10.16 | v37.08,25.4 35.76,24.08 U3.51 35.76,22.05 34.54,20.83 34.54,20.32 34.29,20.07 v34.29,19.56 | 25.65,16 27.43,16
  Top 0.305: U5.17 v54.86,15.24
  Top 0.406: U1.2 11.94,14.99 11.18,14.22 6.17,14.22 J1.4 | U5.4 52.76,26.49 | 56.76,22.49 U5.25
  Bottom 0.254: C5.- 18.8,12.7
  other vias: 77.72,37.08 70.61,38.61 29.97,18.03 17.27,14.73 60.45,9.14 48.77,14.22 70.61,9.14 53.85,27.43 42.16,43.18 17.27,28.96 21.34,32.51 25.4,32.51 31.5,44.2 16.76,36.58 14.22,33.02 27.94,28.96 27.94,5.59 5.08,28.96 5.08,35.05 10.67,8.64 16.26,6.1 32.51,29.97 22.86,43.18 43.18,37.08 47.75,37.08 54.36,34.54 57.91,37.59 45.72,26.42 41.15,24.89 55.88,25.4 70.61,45.21 65.53,16.26 65.53,23.62 65.53,28.7 65.53,34.04 65.53,38.61 81.79,10.41
  pour Top (no thermals): 26.16,16.51 28.7,16.51 28.19,16 25.65,16
  pour Bottom (isolate 0.406, rank 2): 0.51,0.51 99.57,0.51 99.57,49.78 0.51,49.78
  pour Top (isolate 0.406, rank 2): 0.51,0.51 99.57,0.51 99.57,49.78 0.51,49.78
GNDA  (via drill 0.6)
  Top 0.406: U12.19 60.33,74.93 v55.88,74.93 | U13.19 80.64,74.93 v76.2,74.93 | U11.19 40.01,74.93 v35.56,74.93 | U10.19 19.68,74.93 v15.24,74.93
  other vias: 15.24,62.23 35.56,62.23 55.88,62.23 76.2,62.23 93.98,74.93 93.98,60.96 5.08,80.01
  pour Bottom (isolate 0.61): 99.57,85.85 0.51,85.85 0.51,51.31 99.57,51.31
  pour Top (isolate 0.61): 0.51,51.31 99.57,51.31 99.57,85.85 0.51,85.85
GPIOH0
  Top 0.254: U5.2 45.8,28.09 U3.48
GPIOH1
  Top 0.254: U3.52 35.28,25.12 39.05,28.89 U5.1
GPIOH2
  Top 0.254: U3.53 34.77,25.38 39.99,30.59 U5.44
GPIOH3
  Top 0.254: U3.54 34.27,25.63 40.64,32 51.31,32 51.66,31.65 U5.43
GPIOH4
  Top 0.254: U3.55 33.78,25.91 40.39,32.51 51.82,32.51 52.46,31.86 U5.42
GPIOH5
  Top 0.254: U3.57 32.77,25.65 40.13,33.02 52.32,33.02 53.26,32.08 U5.41
GPIOH6
  Top 0.254: U3.58 32.26,25.91 39.88,33.53 52.58,33.53 54.06,32.04 U5.40
GPIOH7
  Top 0.254: U5.39 54.86,32 52.83,34.04 39.62,34.04 31.77,26.19 U3.59
GPIOL0
  Top 0.254: U3.43 41.63,18.52 46.41,23.29 U5.8
GPIOL1
  Top 0.254: U3.44 41.38,19.02 47.24,24.89 U5.6
GPIOL2
  Top 0.254: U3.45 41.12,19.53 47.28,25.69 U5.5
GPIOL3
  Top 0.254: U3.46 40.84,20.02 48.12,27.29 U5.3
IN13
  Top 0.305: J3.10 85.09,24.89 82.55,24.89 81.28,23.62 R17.2
  Top 0.406: J3.10 J4.11
IN14
  Bottom 0.305: R18.2 J3.9
IN15
  Top 0.406: J3.12 J4.13
  Bottom 0.305: J3.12 85.09,19.81 82.55,19.81 81.28,21.08 R19.2
IN28
  Top 0.305: J3.15 R24.2
IN29
  Bottom 0.305: R23.2 81.28,16 82.55,14.73 85.09,14.73 J3.16
IN30
  Bottom 0.305: R22.2 J3.13
IN31
  Top 0.305: J3.14 85.09,19.81 82.55,19.81 81.28,18.54 R21.2
  Top 0.406: J3.14 J4.15
IN32
  Top 0.305: R20.2 J3.11
IO0
  Top 0.305: R9.1 75.57,34.99 U6.6 71.19,36.07 58.93,36.07 55.66,32.8 U5.38
IO1  (via drill 0.5)
  Top 0.305: U5.37 56.46,32.59 58.93,35.05 v67.56,35.05 67.63,34.99 U6.1
  Bottom 0.305: v67.56,35.05 68.83,33.78 R10.1
IO2  (via drill 0.5)
  Top 0.305: U5.36 57.26,32.37 57.91,33.02 v67.56,33.02 67.63,33.09 U6.3
  Bottom 0.305: v67.56,33.02 69.34,31.24 R11.1
IO3
  Top 0.305: R12.1 74.11,31.24 U6.4 71.19,32 60.28,32 U5.34
IO4
  Top 0.305: R13.1 75.57,29.91 U7.6 71.19,30.99 62.66,30.99 U5.33
IO5  (via drill 0.5)
  Top 0.305: U5.32 62.13,28.09 64.01,29.97 v67.56,29.97 67.63,29.91 U7.1
  Bottom 0.305: v67.56,29.97 68.83,28.7 R14.1
IO6  (via drill 0.5)
  Top 0.305: U5.31 66.92,27.29 v67.56,27.94 67.63,28.01 U7.3
  Bottom 0.305: v67.56,27.94 69.34,26.16 R15.1
IO7
  Top 0.305: R16.1 74.11,26.16 U7.4 70.76,26.49 U5.30
IO8
  Top 0.305: R17.1 76.08,24.32 U8.6 70.9,25.69 U5.29
IO9  (via drill 0.5)
  Top 0.305: U5.28 67.06,24.89 v67.56,24.38 67.63,24.32 U8.1
  Bottom 0.305: v67.56,24.38 68.33,23.62 R18.1
IO10  (via drill 0.5)
  Top 0.305: U5.27 62.78,24.09 64.52,22.35 v67.56,22.35 67.63,22.42 U8.3
  Bottom 0.305: v67.56,22.35 68.83,21.08 R19.1
IO11
  Top 0.305: R20.1 73.61,21.08 U8.4 70.74,20.89 U5.23
IO12
  Top 0.305: R21.1 73.61,18.54 U9.6 70.28,19.19 U5.22
IO13  (via drill 0.5)
  Top 0.305: U5.21 58.06,17.63 58.42,17.27 v67.56,17.27 67.63,17.21 U9.1
  Bottom 0.305: v67.56,17.27 68.83,18.54 R22.1
IO14  (via drill 0.5)
  Top 0.305: U9.3 67.63,15.31 v67.56,15.24 59.44,15.24 57.26,17.41 U5.20
  Bottom 0.305: v67.56,15.24 68.33,16 R23.1
IO15
  Top 0.305: R24.1 76.08,15.31 U9.4 71.19,14.22 59.44,14.22 56.46,17.2 U5.19
N$1
  Top 0.254: U3.7 11.43,18.03 10.99,18.48 U1.6
  Top 0.61: J1.2 6.26,18.93 U1.6
N$2
  Top 0.254: U3.8 11.43,17.53 10.99,17.08 U1.1
  Top 0.61: J1.3 6.26,16.63 U1.1
N$3
  Bottom 0.61: L3.2 8.64,31.18 C14.1 8.28,31.67 C11.+ 7.86,34.96 U4.3
N$4
  Top 0.61: J4.2 J4.1 91.42,36.32 85.33,42.42 L4.1
N$5
  Top 0.254: R2.1 17.08,23.62 R3.2
N$6
  Top 0.61: R8.1 LED1.A
N$7
  Top 0.406: U10.9 28.57,60.33 J5.8
N$8
  Top 0.406: U10.8 27.3,59.05 J5.7
N$9
  Top 0.406: U10.7 26.04,57.78 J5.6
N$10
  Top 0.406: U10.6 24.77,56.52 J5.5
N$11
  Top 0.406: U10.5 23.5,56.52 J5.4
N$12
  Top 0.406: U10.4 22.23,57.78 J5.3
N$13
  Top 0.406: U2.4 32.12,33.97 R7.2 R4.2
N$14
  Top 0.406: U10.3 20.95,59.05 J5.2
N$15
  Top 0.406: U10.2 19.68,60.33 J5.1
N$16
  Top 0.406: U10.11 29.84,78.11 J7.8
N$17
  Top 0.406: U10.12 28.57,79.38 J7.7
N$18
  Top 0.406: U10.13 27.3,80.64 J7.6
N$19
  Top 0.406: U10.14 26.04,80.64 J7.5
N$20
  Top 0.406: U10.15 24.77,79.38 J7.4
N$21
  Top 0.406: U10.16 23.5,78.11 J7.3
N$22
  Top 0.406: U10.17 22.23,76.83 J7.2
N$23
  Top 0.406: U10.18 20.95,75.56 J7.1
N$24
  Top 0.406: U11.9 48.9,60.33 J6.8
N$25
  Top 0.406: U11.8 47.62,59.05 J6.7
N$26
  Top 0.406: U11.7 46.35,57.78 J6.6
N$27
  Top 0.406: U11.6 45.09,56.52 J6.5
N$28
  Top 0.406: U11.5 43.81,56.52 J6.4
N$29
  Top 0.406: U11.4 42.55,57.78 J6.3
N$30
  Top 0.406: U11.3 41.27,59.05 J6.2
N$31
  Top 0.406: U11.2 40.01,60.33 J6.1
N$32
  Top 0.406: U11.11 50.16,78.11 J8.8
N$33
  Top 0.406: U11.12 48.9,79.38 J8.7
N$34
  Top 0.406: U11.13 47.62,80.64 J8.6
N$35
  Top 0.406: U11.14 46.35,80.64 J8.5
N$36
  Top 0.406: U11.15 45.09,79.38 J8.4
N$37
  Top 0.406: U11.16 43.81,78.11 J8.3
N$38
  Top 0.406: U11.17 42.55,76.83 J8.2
N$39
  Top 0.406: U11.18 41.27,75.56 J8.1
N$40
  Top 0.406: U12.9 69.22,60.33 J9.8
N$41
  Top 0.406: U12.8 67.94,59.05 J9.7
N$42
  Top 0.406: U12.7 66.67,57.78 J9.6
N$43
  Top 0.406: U12.6 65.41,56.52 J9.5
N$44
  Top 0.406: U12.5 64.14,56.52 J9.4
N$45
  Top 0.406: U12.4 62.87,57.78 J9.3
N$46
  Top 0.406: U12.3 61.59,59.05 J9.2
N$47
  Top 0.406: U12.2 60.33,60.33 J9.1
N$48
  Top 0.406: U12.11 70.48,78.11 J12.8
N$49
  Top 0.406: U12.12 69.22,79.38 J12.7
N$50
  Top 0.406: U12.13 67.94,80.64 J12.6
N$51
  Top 0.406: U12.14 66.67,80.64 J12.5
N$52
  Top 0.406: U12.15 65.41,79.38 J12.4
N$53
  Top 0.406: U12.16 64.14,78.11 J12.3
N$54
  Top 0.406: U12.17 62.87,76.83 J12.2
N$55
  Top 0.406: U12.18 61.59,75.56 J12.1
N$56
  Top 0.406: U13.9 89.53,60.33 J10.8
N$57
  Top 0.406: U13.8 88.27,59.05 J10.7
N$58
  Top 0.406: U13.7 87,57.78 J10.6
N$59
  Top 0.406: U13.6 85.72,56.52 J10.5
N$60
  Top 0.406: U13.5 84.45,56.52 J10.4
N$61
  Top 0.406: U13.4 83.19,57.78 J10.3
N$62
  Top 0.406: U13.3 81.92,59.05 J10.2
N$63
  Top 0.406: U13.2 80.64,60.33 J10.1
N$64
  Top 0.406: U13.11 90.81,78.11 J13.8
N$65
  Top 0.406: U13.12 89.53,79.38 J13.7
N$66
  Top 0.406: U13.13 88.27,80.64 J13.6
N$67
  Top 0.406: U13.14 87,80.64 J13.5
N$68
  Top 0.406: U13.15 85.72,79.38 J13.4
N$69
  Top 0.406: U13.16 84.45,78.11 J13.3
N$70
  Top 0.406: U13.17 83.19,76.83 J13.2
N$71
  Top 0.406: U13.18 81.92,75.56 J13.1
OUT4
  Top 0.305: J3.2 85.09,35.05 82.55,35.05 81.28,33.78 R9.2
  Top 0.406: J3.2 J4.3
OUT5
  Bottom 0.305: R10.2 J3.1
OUT6
  Top 0.406: J3.4 J4.5
  Bottom 0.305: R11.2 81.41,31.24 82.68,29.97 85.09,29.97 J3.4
OUT7
  Top 0.305: R12.2 J3.3
OUT8
  Top 0.305: J3.6 85.09,29.97 82.55,29.97 81.28,28.7 R13.2
  Top 0.406: J3.6 J4.7
OUT9
  Bottom 0.305: J3.5 R14.2
OUT10
  Top 0.406: J3.8 J4.9
  Bottom 0.305: R15.2 81.53,26.16 82.8,24.89 85.09,24.89 J3.8
OUT11
  Top 0.305: R16.2 J3.7
REF
  Top 0.254: U3.6 21.04,18.52 R2.2
TCK
  Top 0.254: U5.16 54.06,18 52.07,16 38.76,16 U3.38
TDI
  Top 0.254: U5.14 52.46,17.92 51.05,16.51 U3.39
TDO
  Top 0.254: U5.13 51.66,18.39 50.29,17.02 U3.40
TGT  (via drill 0.5)
  Top 0.406: U5.26 58.5,23.29 v57.91,23.88
  Bottom 0.305: 60.39,23.37 C23.1
  Bottom 0.406: C23.1 58.49,23.3 v57.91,23.88
  Bottom 0.61: 60.39,23.37 60.39,41.84 J2.2
TMS
  Top 0.254: U5.12 50.69,19.19 49.02,17.53 U3.41
VCC
  Top 0.61: U10.20 18.41,69.22 | 18.41,69.22 19.05,68.58 35.24,68.58 C28.1 35.88,68.58 38.1,68.58 38.73,69.22 | 18.41,69.22 17.46,68.26 C29.1 11.52,68.26 C30.+ 7.85,68.35 D1.C | U11.20 38.73,69.22 | 38.73,69.22 39.37,68.58 55.56,68.58 C27.1 56.2,68.58 58.42,68.58 59.05,69.22 | U12.20 59.05,69.22 | 59.05,69.22 59.69,68.58 75.88,68.58 C26.1 76.52,68.58 78.74,68.58 79.38,69.22 U13.20
VPHY  (via drill 0.5)
  Top 0.254: U3.4 24.16,19.53 v23.88,19.81
  Bottom 0.406: 21.91,19.81 v23.88,19.81
  Bottom 0.61: 21.91,19.81 C4.1 18.88,19.88 C6.+ 18.65,19.81 L2.2
VPLL  (via drill 0.5)
  Top 0.254: U3.9 24.64,17.02 v23.62,16
  Bottom 0.61: L1.2 21.59,12.55 C5.+ 21.52,12.78 C3.1 v23.62,16
VREF
  Top 0.61: L4.2 77.79,42.42 C24.1 74,42.35 C25.+ 73.77,42.42 J2.3
XTIN
  Top 0.254: U3.2 25.7,20.52 23.88,22.35 23.88,23.85 X1.P$2
  Top 0.61: X1.P$2 25.4,25.38 C1.1
XTOUT
  Top 0.254: U3.3 25.2,20.02 22.86,22.35 22.86,23.85 X1.P$1
  Top 0.61: X1.P$1 21.34,25.38 C2.1

### Text on the board
tPlace: 3.3v | Vext | mixJTAG | v1.0
bPlace: 1 / 2 / 3 / 4 / 5 / 6 / 7 / 8 / 9 / 10 / 11 / 12 / 13 / 14 / 15 / 16 / 17 / 18 / 19 / 20 / 21 / 22 / 23 / 24 / 25 / 26 / 27 / 28 / 29 / 30 / 31 / 32 | IOBuf | 1 / 2 / 3 / 4 / 5 / 6 / 7 / 8 / 9 / 10 / 11 / 12 / 13 / 14 / 15 / 16 / 17 / 18 / 19 / 20 / 21 / 22 / 23 / 24 / 25 / 26 / 27 / 28 / 29 / 30 / 31 / 32 | VTref / nTRST / TDI / TMS / TCK / RTCK / TDO / nSRST / DBGRQ / DBGACK | Vsup / GND / GND / GND / GND / GND / GND / GND / GND / GND